# Altium project BCI_EEG.PrjPcb
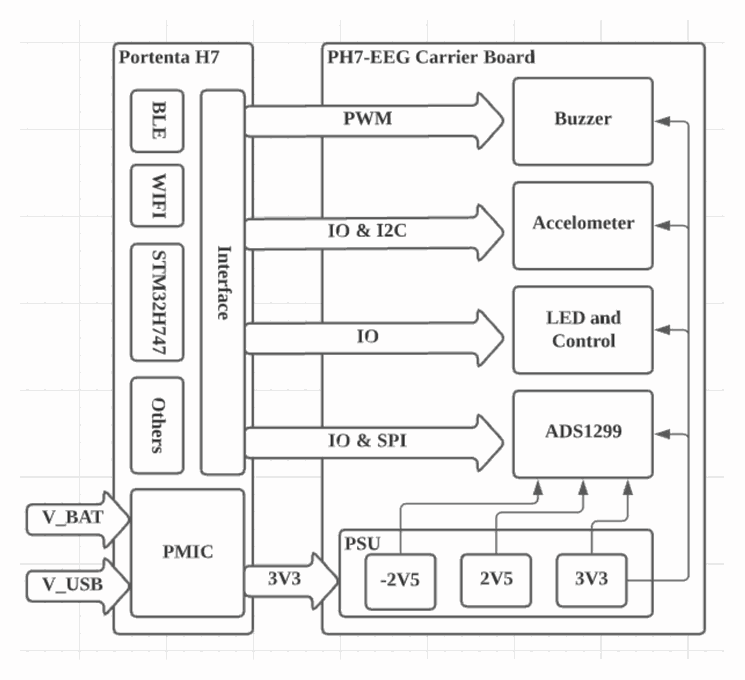
[diagram p0: Block Diagram.SchDoc]
4 sheets, 167 parts. Net scope: global (net labels, ports and power ports of the same name join across sheets).
Board file: BCI_EEG.pcbdoc
Sheets:
  Block Diagram.SchDoc
  EEG Front-End.SchDoc
  MainBoardNew.SchDoc
  PWR & Sensor Input.SchDoc

## Sheet Block Diagram.SchDoc
size A4

## Sheet EEG Front-End.SchDoc
size A4
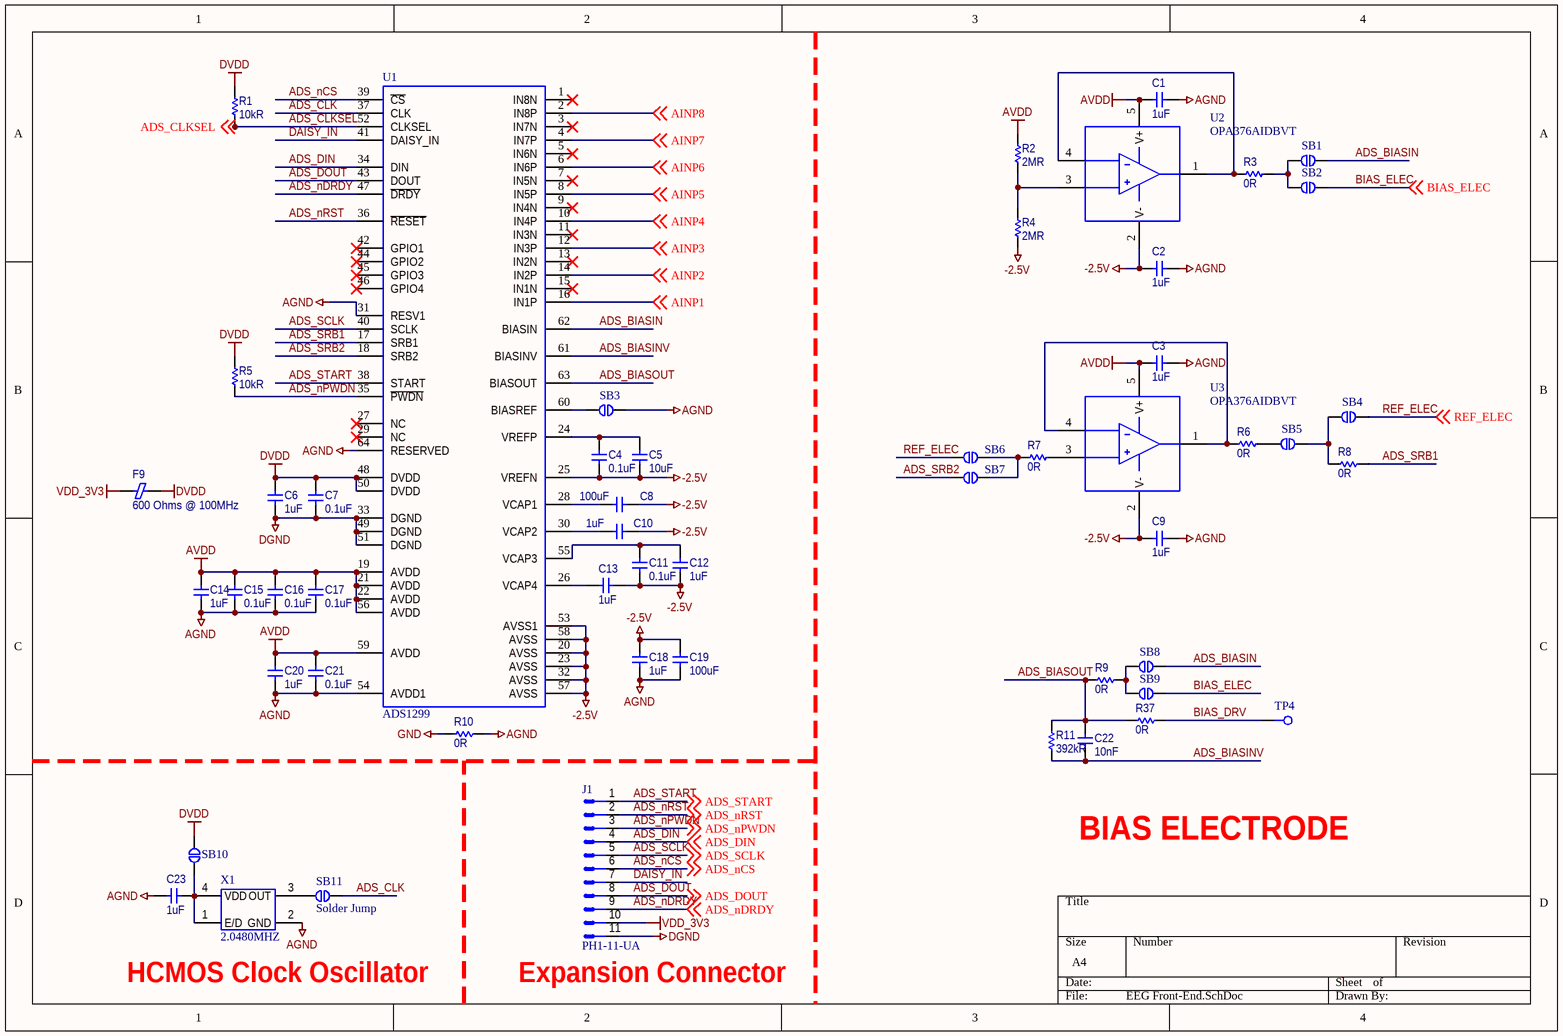
[diagram p1: EEG Front-End.SchDoc]

### Parts
C1  1uF  [C1005X04N]
C2  1uF  [C1005X04N]
C3  1uF  [C1005X04N]
C4  0.1uF  [C1005X04N]
C5  10uF  [C1608X06N]
C6  1uF  [C1005X04N]
C7  0.1uF  [C1005X04N]
C8  100uF  [C2012X06N]
C9  1uF  [C1005X04N]
C10  1uF  [C1005X04N]
C11  0.1uF  [C1005X04N]
C12  1uF  [C1005X04N]
C13  1uF  [C1005X04N]
C14  1uF  [C1005X04N]
C15  0.1uF  [C1005X04N]
C16  0.1uF  [C1005X04N]
C17  0.1uF  [C1005X04N]
C18  1uF  [C1005X04N]
C19  100uF  [C2012X06N]
C20  1uF  [C1005X04N]
C21  0.1uF  [C1005X04N]
C22  10nF  [C1005X04N]
C23  1uF  [C1005X04N]
F9  600 Ohms @ 100MHz  [F1005X04N]
J1  PH1-11-UA  [HDR1x11 - 2.54mm]
R1  10kR  [R1005X04N]
R2  2MR  [R1005X04N]
R3  0R  [R1005X04N]
R4  2MR  [R1005X04N]
R5  10kR  [R1005X04N]
R6  0R  [R1005X04N]
R7  0R  [R1005X04N]
R8  0R  [R1005X04N]
R9  0R  [R1005X04N]
R10  0R  [R1005X04N]
R11  392kR  [R1005X04N]
R37  0R  [R1005X04N]
SB1  Solder Jump  [SJB_0603]  (value not drawn)
SB2  Solder Jump  [SJB_0603]  (value not drawn)
SB3  Solder Jump  [SJB_0603]  (value not drawn)
SB4  Solder Jump  [SJB_0603]  (value not drawn)
SB5  Solder Jump  [SJB_0603]  (value not drawn)
SB6  Solder Jump  [SJB_0603]  (value not drawn)
SB7  Solder Jump  [SJB_0603]  (value not drawn)
SB8  Solder Jump  [SJB_0603]  (value not drawn)
SB9  Solder Jump  [SJB_0603]  (value not drawn)
SB10  Solder Jump  [SJB_0603]  (value not drawn)
SB11  Solder Jump  [SJB_0603]
TP4  TP_25MILC  [TESTPOINT_1MM]  (value not drawn)  (no BOM)
U1  ADS1299  [PQFN-64]
U2  OPA376AIDBVT  [SOT23-5]
U3  OPA376AIDBVT  [SOT23-5]
X1  2.0480MHZ  [CRYSTAL_3225]

### Nets
-2.5V: C2.2 C4.1 C5.1 C8.2 C9.2 C10.2 C11.1 C12.2 C13.1 C18.2 C19.2 R4.1 U1.20(AVSS) U1.23(AVSS) U1.25(VREFN) U1.32(AVSS) U1.53(AVSS1) U1.57(AVSS) U1.58(AVSS) U2.2(V-) U3.2(V-)
AGND: C1.1 C2.1 C3.1 C9.1 C14.2 C15.1 C16.1 C17.1 C18.1 C19.1 C20.2 C21.1 C23.1 R10.2 SB3.1 U1.31(RESV1) U1.54(AVDD1) U1.64(RESERVED) X1.2(GND)
AVDD: C1.2 C3.2 C14.1 C15.2 C16.2 C17.2 C20.1 C21.2 R2.2 U1.19(AVDD) U1.21(AVDD) U1.22(AVDD) U1.56(AVDD) U1.59(AVDD) U2.5(V+) U3.5(V+)
DGND: C6.2 C7.1 J1.11 U1.33(DGND) U1.49(DGND) U1.51(DGND)
DVDD: C6.1 C7.2 F9.2 R1.2 R5.2 SB10.1 U1.48(DVDD) U1.50(DVDD)
GND: R10.1
VDD_3V3: F9.1 J1.10
ADS_BIASIN: SB1.1 SB8.1 U1.62(BIASIN)
ADS_BIASINV: C22.1 R11.1 U1.61(BIASINV)
ADS_BIASOUT: C22.2 R9.1 R11.2 R37.1 U1.63(BIASOUT)
ADS_CLK: SB11.2 U1.37(CLK)
ADS_CLKSEL: R1.1 U1.52(CLKSEL) ; off-sheet ADS_CLKSEL
ADS_DIN: J1.4 U1.34(DIN) ; off-sheet ADS_DIN
ADS_DOUT: J1.8 U1.43(DOUT) ; off-sheet ADS_DOUT
ADS_nCS: J1.6 U1.39(~{CS}) ; off-sheet ADS_nCS
ADS_nDRDY: J1.9 U1.47(~{DRDY}) ; off-sheet ADS_nDRDY
ADS_nPWDN: J1.3 R5.1 U1.35(~{PWDN}) ; off-sheet ADS_nPWDN
ADS_nRST: J1.2 U1.36(~{RESET}) ; off-sheet ADS_nRST
ADS_SCLK: J1.5 U1.40(SCLK) ; off-sheet ADS_SCLK
ADS_SRB1: R8.2 U1.17(SRB1)
ADS_SRB2: SB7.2 U1.18(SRB2)
ADS_START: J1.1 U1.38(START) ; off-sheet ADS_START
AINP1: U1.16(IN1P) ; off-sheet AINP1
AINP2: U1.14(IN2P) ; off-sheet AINP2
AINP3: U1.12(IN3P) ; off-sheet AINP3
AINP4: U1.10(IN4P) ; off-sheet AINP4
AINP5: U1.8(IN5P) ; off-sheet AINP5
AINP6: U1.6(IN6P) ; off-sheet AINP6
AINP7: U1.4(IN7P) ; off-sheet AINP7
AINP8: U1.2(IN8P) ; off-sheet AINP8
BIAS_DRV: R37.2 TP4.1
BIAS_ELEC: SB2.1 SB9.1 ; off-sheet BIAS_ELEC
DAISY_IN: J1.7 U1.41(DAISY_IN)
REF_ELEC: SB4.2 SB6.2 ; off-sheet REF_ELEC
NetC4_2: C4.2 C5.2 U1.24(VREFP)
NetC8_1: C8.1 U1.28(VCAP1)
NetC10_1: C10.1 U1.30(VCAP2)
NetC11_2: C11.2 C12.1 U1.55(VCAP3)
NetC13_2: C13.2 U1.26(VCAP4)
NetC23_2: C23.2 SB10.2 X1.1(E/D) X1.4(VDD)
NetR2_1: R2.1 R4.2 U2.3(IN+)
NetR3_1: R3.1 U2.1(VO) U2.4(IN-)
NetR3_2: R3.2 SB1.2 SB2.2
NetR6_1: R6.1 U3.1(VO) U3.4(IN-)
NetR6_2: R6.2 SB5.2
NetR7_1: R7.1 SB6.1 SB7.1
NetR7_2: R7.2 U3.3(IN+)
NetR8_1: R8.1 SB4.1 SB5.1
NetR9_2: R9.2 SB8.2 SB9.2
NetSB3_2: SB3.2 U1.60(BIASREF)
NetSB11_1: SB11.1 X1.3(OUT)

Not connected (* = marked no-connect by the designer): U1 1(IN8N)* 3(IN7N)* 5(IN6N)* 7(IN5N)* 9(IN4N)* 11(IN3N)* 13(IN2N)* 15(IN1N)* 27(NC)* 29(NC)* 42(GPIO1)* 44(GPIO2)* 45(GPIO3)* 46(GPIO4)*

### Notes on the sheet
- BIAS ELECTRODE
- (near X1) HCMOS Clock Oscillator
- (near J1) Expansion Connector

### Library data of the parts
C1-C3 C6 C9 C10 C12-C14 C18 C20 C23 = EMK105BJ105KV-F: CAP CER,1UF,10%,16V,X5R,0402,SMD; Manufacturer: Taiyo Yuden; No: 96; Capacitor Type: Ceramic Capacitor; Manufacturer Part Number: EMK105BJ105KV-F; VNPT Part Number: EMK105BJ105KV-F; Capacitance: 1uF; Voltage - Rated: 16V; Tolerance: 10%; Mounting Type: Surface Mount (SMD); Package: 0402; Temperature Coefficient: X5R
C4 C7 C11 C15-C17 C21 = TMK105BJ104MV-F: CAP CER,0.1UF,20%,25V,X5R,0402,SMD; Manufacturer: Taiyo Yuden; No: 79; Capacitor Type: Ceramic Capacitor; Manufacturer Part Number: TMK105BJ104MV-F; VNPT Part Number: TMK105BJ104MV-F; Capacitance: 0.1uF; Voltage - Rated: 25V; Tolerance: 20%; Mounting Type: Surface Mount (SMD); Package: 0402; Temperature Coefficient: X5R
C5 = LMK107BBJ106MAHT: CAP CER,10UF,20%,10V,X5R,0603,SMD; Manufacturer: Taiyo Yuden; No: 31; Capacitor Type: Ceramic Capacitor; Manufacturer Part Number: LMK107BBJ106MAHT; VNPT Part Number: LMK107BBJ106MAHT; Capacitance: 10uF; Voltage - Rated: 10V; Tolerance: 20%; Mounting Type: Surface Mount (SMD); Package: 0603; Temperature Coefficient: X5R
C8 C19 = GRM21BR60J107ME15L: CAP CER,100UF,20%,6.3V,X5R,0805,SMD; Manufacturer: Murata Electronics; No: 71; Capacitor Type: Ceramic Capacitor; Manufacturer Part Number: GRM21BR60J107ME15L; VNPT Part Number: GRM21BR60J107ME15L; Capacitance: 100uF; Voltage - Rated: 6.3V; Tolerance: 20%; Mounting Type: Surface Mount (SMD); Package: 0805; Temperature Coefficient: X5R
C22 = UMK105B7103KV-F: CAP CER,10NF,10%,50V,X7R,0402,SMD; Manufacturer: Taiyo Yuden; No: 33; Capacitor Type: Ceramic Capacitor; Manufacturer Part Number: UMK105B7103KV-F; VNPT Part Number: UMK105B7103KV-F; Capacitance: 10nF; Voltage - Rated: 50V; Tolerance: 10%; Mounting Type: Surface Mount (SMD); Package: 0402; Temperature Coefficient: X7R
F9 = BK1005HS601-T: FERRITE BEAD,600 OHMS @ 100MHZ,0.55R,300MA,0402,SMD; Manufacturer: Taiyo Yuden; No: 3; Manufacturer Part Number: BK1005HS601-T; VNPT Part Number: BK1005HS601-T; Impedance: 600 Ohms @ 100MHz; DC Resistance (DCR): 0.55R; Current Rating: 300mA; Mounting Type: Surface Mount (SMD); Package: 0402
J1 = PH1-11-UA: CONN HEADER VERT 11POS 2.54MM
R1 R5 = RC0402FR-0710KL: RES,10KR,1%,62.5MW,0402,SMD; Manufacturer: Yageo; No: 35; Manufacturer Part Number: RC0402FR-0710KL; VNPT Part Number: RC0402FR-0710KL; Resistance: 10kR; Tolerance: 1%; Power: 62.5mW; Resistor Type: Genneral Purpose Resistor; Mounting Type: Surface Mount (SMD); Package: 0402
R2 R4 = CRCW04022M00FKEDC: RES,2MR,1%,62.5MW,0402,SMD; Manufacturer: Vishay / Dale; No: 135; Manufacturer Part Number: CRCW04022M00FKEDC; VNPT Part Number: CRCW04022M00FKEDC; Resistance: 2MR; Tolerance: 1%; Power: 62.5mW; Resistor Type: Genneral Purpose Resistor; Mounting Type: Surface Mount (SMD); Package: 0402
R3 R6-R10 R37 = RC0402FR-070RL: RES,0R,JUMPER,62.5MW,0402,SMD; Manufacturer: Yageo; No: 7; Manufacturer Part Number: RC0402FR-070RL; VNPT Part Number: RC0402FR-070RL; Resistance: 0R; Tolerance: JUMPER; Power: 62.5mW; Resistor Type: Genneral Purpose Resistor; Mounting Type: Surface Mount (SMD); Package: 0402
R11 = CRCW0402392KFKED: RES,392KR,1%,62.5MW,0402,SMD; Manufacturer: Vishay / Dale; No: 136; Manufacturer Part Number: CRCW0402392KFKED; VNPT Part Number: CRCW0402392KFKED; Resistance: 392kR; Tolerance: 1%; Power: 62.5mW; Resistor Type: Genneral Purpose Resistor; Mounting Type: Surface Mount (SMD); Package: 0402
SB1-SB11 = Solder Jump: Solder Bridge Jumper 0603
TP4 = TP_25MILC: Test Point 25mil
U1 = ADS1299IPAGR: IC AFE 8 CHAN 24BIT 64TQFP; Manufacturer: Texas Instruments; Manufacturer Part Number: ADS1299IPAGR
U2 U3 = OPA376AIDBVT: IC OPAMP GP 1 CIRCUIT SOT23-5; Manufacturer: Texas Instruments; Manufacturer Part Number: OPA376AIDBVT
X1 = 632L3I002M04800: XTAL OSC XO 2.0480MHZ HCMOS SMD; Manufacturer: CTS-Frequency Controls; Parameter 1: *

## Sheet MainBoardNew.SchDoc
size A4
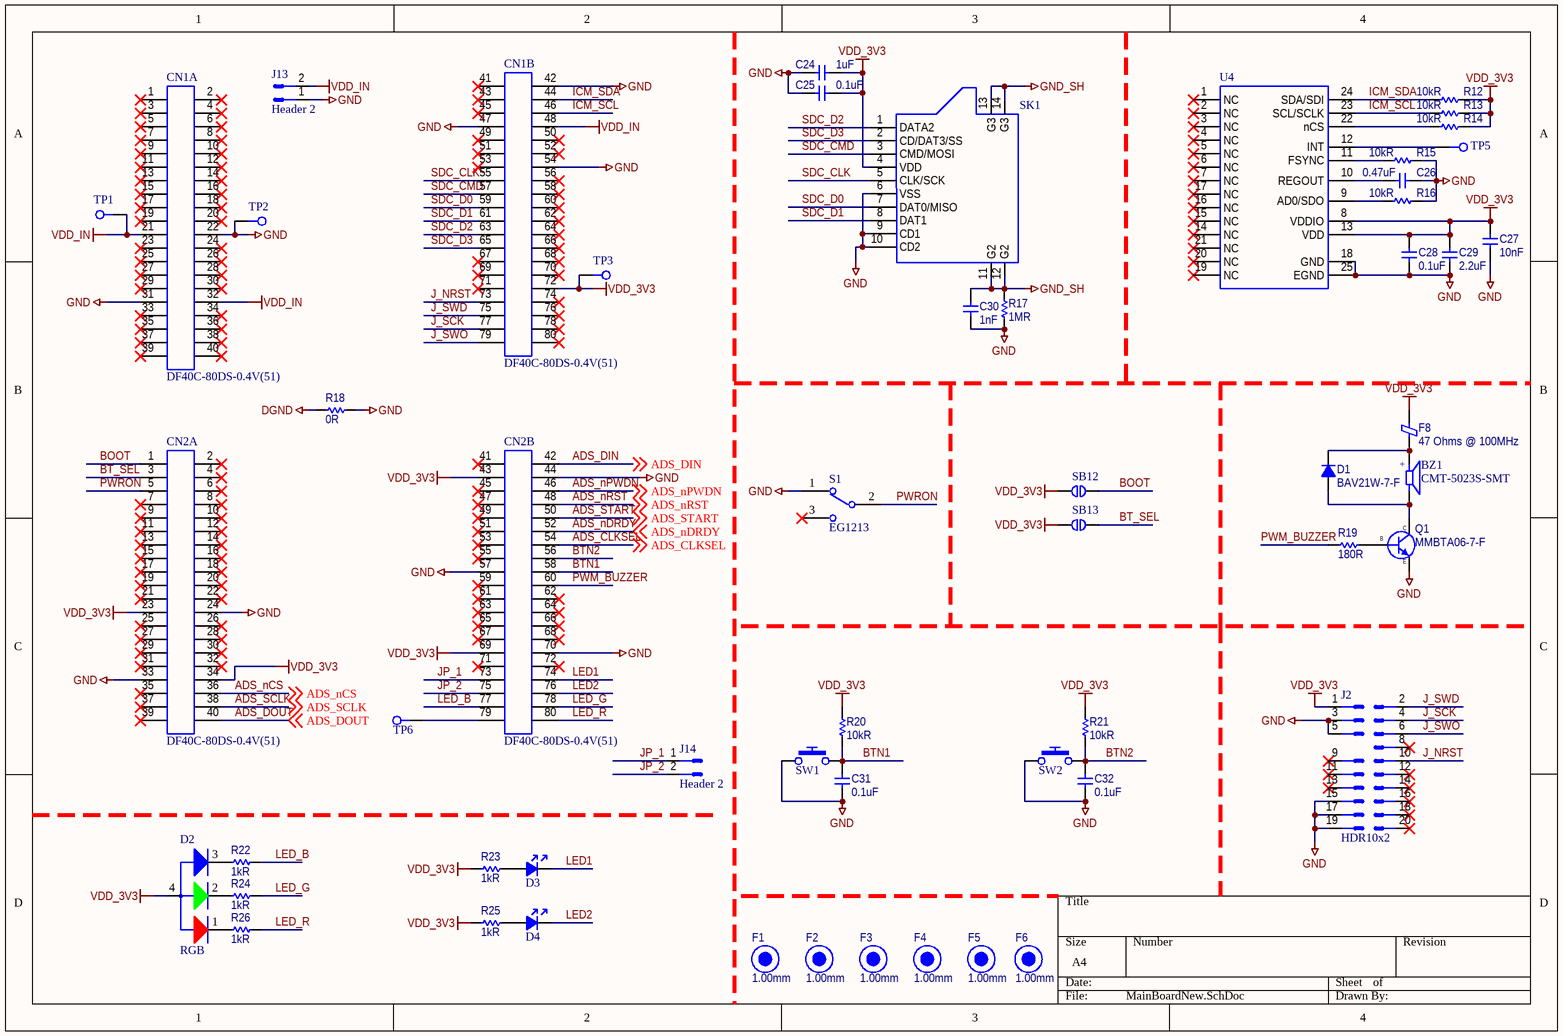
[diagram p2: MainBoardNew.SchDoc]

### Parts
BZ1  CMT-5023S-SMT  [CUI_CMT-5023S-SMT]
C24  1uF  [C1005X04N]
C25  0.1uF  [C1005X04N]
C26  0.47uF  [C1005X04N]
C27  10nF  [C1005X04N]
C28  0.1uF  [C1005X04N]
C29  2.2uF  [C1005X04N]
C30  1nF  [C1005X04N]
C31  0.1uF  [C1005X04N]
C32  0.1uF  [C1005X04N]
CN1  DF40C-80DS-0.4V(51)  [DF40C-80DS-0.4V(51)]  (parts A,B of 2)
CN2  DF40C-80DS-0.4V(51)  [DF40C-80DS-0.4V(51)]  (parts A,B of 2)
D1  BAV21W-7-F  [SOD123]
D2  RGB  [LED 3528 PLCC4 RGB]
D3  LED BLUE  [LED0603]  (value not drawn)
D4  LED BLUE  [LED0603]  (value not drawn)
F1  1.00mm  [FIDUCIAL10-30]
F2  1.00mm  [FIDUCIAL10-30]
F3  1.00mm  [FIDUCIAL10-30]
F4  1.00mm  [FIDUCIAL10-30]
F5  1.00mm  [FIDUCIAL10-30]
F6  1.00mm  [FIDUCIAL10-30]
F8  47 Ohms @ 100MHz  [F2012X06N]
J2  HDR10x2  [FTSH-110-01-L-DV-007-P-TR]
J13  Header 2  [HDR1x2]
J14  Header 2  [HDR1x2]
Q1  MMBTA06-7-F  [SOT95P245X110-3N]
R12  10kR  [R1005X04N]
R13  10kR  [R1005X04N]
R14  10kR  [R1005X04N]
R15  10kR  [R1005X04N]
R16  10kR  [R1005X04N]
R17  1MR  [R1005X04N]
R18  0R  [R1005X04N]
R19  180R  [R1005X04N]
R20  10kR  [R1005X04N]
R21  10kR  [R1005X04N]
R22  1kR  [R1005X04N]
R23  1kR  [R1005X04N]
R24  1kR  [R1005X04N]
R25  1kR  [R1005X04N]
R26  1kR  [R1005X04N]
S1  EG1213  [SW_EG1213]
SB12  Solder Jump  [SJB_0603]  (value not drawn)
SB13  Solder Jump  [SJB_0603]  (value not drawn)
SK1  MICRO SD CARD  [114-00841-68]  (value not drawn)
SW1  FSMRA4JH04  [1-1825027-1]  (value not drawn)
SW2  FSMRA4JH04  [1-1825027-1]  (value not drawn)
TP1  TP_25MILC  [TESTPOINT_1MM]  (value not drawn)  (no BOM)
TP2  TP_25MILC  [TESTPOINT_1MM]  (value not drawn)  (no BOM)
TP3  TP_25MILC  [TESTPOINT_1MM]  (value not drawn)  (no BOM)
TP5  TP_25MILC  [TESTPOINT_1MM]  (value not drawn)  (no BOM)
TP6  TP_25MILC  [TESTPOINT_1MM]  (value not drawn)  (no BOM)
U4  ICM-20689  [QFN50P400X400X100_HS-25N-NP]  (value not drawn)

### Nets
DGND: R18.1
GND: C24.1 C25.2 C26.2 C27.1 C28.2 C29.1 C30.1 C31.1 C32.1 CN1.22 CN1.31 CN1.42 CN1.47 CN1.54 CN2.24 CN2.33 CN2.44 CN2.57 CN2.70 J2.3 J2.5 J2.15 J2.17 J2.19 J13.1 Q1.2(E) R15.1 R16.1 R17.1 R18.2 S1.1 SK1.6(VSS) SK1.9(CD1) SK1.10(CD2) SW1.1 SW2.1 TP2.1 U4.18(GND) U4.25(EGND)
GND_SH: C30.2 R17.2 SK1.11(G2) SK1.12(G2) SK1.13(G3) SK1.14(G3)
VDD_3V3: C24.2 C25.1 C27.2 C28.1 C29.2 CN1.72 CN2.23 CN2.34 CN2.43 CN2.69 D2.4(COMM_ANODE) F8.2 J2.1 R12.1 R13.1 R14.1 R20.2 R21.2 R23.1 R25.1 SB12.2 SB13.2 SK1.4(VDD) TP3.1 U4.8(VDDIO) U4.13(VDD)
VDD_IN: CN1.21 CN1.32 CN1.48 J13.2 TP1.1
ADS_CLKSEL: CN2.54 ; off-sheet ADS_CLKSEL
ADS_DIN: CN2.42 ; off-sheet ADS_DIN
ADS_DOUT: CN2.40 ; off-sheet ADS_DOUT
ADS_nCS: CN2.36 ; off-sheet ADS_nCS
ADS_nDRDY: CN2.52 ; off-sheet ADS_nDRDY
ADS_nPWDN: CN2.46 ; off-sheet ADS_nPWDN
ADS_nRST: CN2.48 ; off-sheet ADS_nRST
ADS_SCLK: CN2.38 ; off-sheet ADS_SCLK
ADS_START: CN2.50 ; off-sheet ADS_START
BOOT: CN2.1 SB12.1
BT_SEL: CN2.3 SB13.1
BTN1: C31.2 CN2.58 R20.1 SW1.2
BTN2: C32.2 CN2.56 R21.1 SW2.2
ICM_SCL: CN1.46 R13.2 U4.23(SCL/SCLK)
ICM_SDA: CN1.44 R12.2 U4.24(SDA/SDI)
J_NRST: CN1.73 J2.10
J_SCK: CN1.77 J2.4
J_SWD: CN1.75 J2.2
J_SWO: CN1.79 J2.6
JP_1: CN2.73 J14.1
JP_2: CN2.75 J14.2
LED1: CN2.74 D3.2(K)
LED2: CN2.76 D4.2(K)
LED_B: CN2.77 R22.2
LED_G: CN2.78 R24.2
LED_R: CN2.80 R26.2
PWM_BUZZER: CN2.60 R19.1
PWRON: CN2.5 S1.2
SDC_CLK: CN1.55 SK1.5(CLK/SCK)
SDC_CMD: CN1.57 SK1.3(CMD/MOSI)
SDC_D0: CN1.59 SK1.7(DAT0/MISO)
SDC_D1: CN1.61 SK1.8(DAT1)
SDC_D2: CN1.63 SK1.1(DATA2)
SDC_D3: CN1.65 SK1.2(CD/DAT3/SS)
NetBZ1_N: BZ1.N D1.2(A) Q1.3(C)
NetBZ1_P: BZ1.P D1.1(C) F8.1
NetC26_1: C26.1 U4.10(REGOUT)
NetCN2_79: CN2.79 TP6.1
NetD2_1: D2.1(CATHODE_RED) R26.1
NetD2_2: D2.2(CATHODE_GREEN) R24.1
NetD2_3: D2.3(CATHODE_BLUE) R22.1
NetD3_1: D3.1(A) R23.2
NetD4_1: D4.1(A) R25.2
NetQ1_1: Q1.1(B) R19.2
NetR14_2: R14.2 U4.22(nCS)
NetR15_2: R15.2 U4.11(FSYNC)
NetR16_2: R16.2 U4.9(AD0/SDO)
NetTP5_1: TP5.1 U4.12(INT)

Not connected (* = marked no-connect by the designer): CN1 1* 2* 3* 4* 5* 6* 7* 8* 9* 10* 11* 12* 13* 14* 15* 16* 17* 18* 19* 20* 23* 24* 25* 26* 27* 28* 29* 30* 33* 34* 35* 36* 37* 38* 39* 40* 41* 43* 45* 49* 50* 51* 52* 53* 56* 58* 60* 62* 64* 66* 67* 68* 69* 70* 71* 74* 76* 78* 80*; CN2 2* 4* 6* 7* 8* 9* 10* 11* 12* 13* 14* 15* 16* 17* 18* 19* 20* 21* 22* 25* 26* 27* 28* 29* 30* 31* 32* 35* 37* 39* 41* 45* 47* 49* 51* 53* 55* 59* 61* 62* 63* 64* 65* 66* 67* 68* 71* 72*; J2 8* 9* 11* 12* 13* 14* 16* 18* 20*; S1 3*; U4 1(NC)* 2(NC)* 3(NC)* 4(NC)* 5(NC)* 6(NC)* 7(NC)* 14(NC)* 15(NC)* 16(NC)* 17(NC)* 19(NC)* 20(NC)* 21(NC)*

### Notes on the sheet
- (in symbol CMT-5023S-SMT) +

### Library data of the parts
BZ1 = CMT-5023S-SMT: AUDIO MAGNETIC XDCR 2-4V SMD; Manufacturer: CUI Devices; Manufacturer Part Number: CMT-5023S-SMT-TR
C24 = EMK105BJ105KV-F: as C1 on sheet EEG Front-End; Manufacturer Part Number: EMK105BJ105KV-F; VNPT Part Number: EMK105BJ105KV-F; Capacitance: 1uF; Voltage - Rated: 16V; Tolerance: 10%; Mounting Type: Surface Mount (SMD); Package: 0402; Temperature Coefficient: X5R
C25 C28 C31 C32 = TMK105BJ104MV-F: as C4 on sheet EEG Front-End; Manufacturer Part Number: TMK105BJ104MV-F; VNPT Part Number: TMK105BJ104MV-F; Capacitance: 0.1uF; Voltage - Rated: 25V; Tolerance: 20%; Mounting Type: Surface Mount (SMD); Package: 0402; Temperature Coefficient: X5R
C26 = TMK105ABJ474KVHF: CAP CER,0.47UF,10%,25V,X5R,0402,SMD; Manufacturer: Taiyo Yuden; No: 122; Capacitor Type: Ceramic Capacitor; Manufacturer Part Number: TMK105ABJ474KVHF; VNPT Part Number: TMK105ABJ474KVHF; Capacitance: 0.47uF; Voltage - Rated: 25V; Tolerance: 10%; Mounting Type: Surface Mount (SMD); Package: 0402; Temperature Coefficient: X5R
C27 = UMK105B7103KV-F: as C22 on sheet EEG Front-End; Manufacturer Part Number: UMK105B7103KV-F; VNPT Part Number: UMK105B7103KV-F; Capacitance: 10nF; Voltage - Rated: 50V; Tolerance: 10%; Mounting Type: Surface Mount (SMD); Package: 0402; Temperature Coefficient: X7R
C29 = TMK105CBJ225MV-F: CAP CER,2.2UF,20%,25V,X5R,0402,SMD; Manufacturer: Taiyo Yuden; No: 140; Capacitor Type: Ceramic Capacitor; Manufacturer Part Number: TMK105CBJ225MV-F; VNPT Part Number: TMK105CBJ225MV-F; Capacitance: 2.2uF; Voltage - Rated: 25V; Tolerance: 20%; Mounting Type: Surface Mount (SMD); Package: 0402; Temperature Coefficient: X5R
C30 = UMK105B7102KV-F: CAP CER,1NF,10%,50V,X7R,0402,SMD; Manufacturer: Taiyo Yuden; No: 120; Capacitor Type: Ceramic Capacitor; Manufacturer Part Number: UMK105B7102KV-F; VNPT Part Number: UMK105B7102KV-F; Capacitance: 1nF; Voltage - Rated: 50V; Tolerance: 10%; Mounting Type: Surface Mount (SMD); Package: 0402; Temperature Coefficient: X7R
CN1 CN2 = DF40C-80DS-0.4V(51): CONN RCPT 80POS SMD GOLD; Manufacturer: Hirose Electric Co Ltd; Manufacturer Part Number: DF40C-80DS-0.4V(51)
D1 = BAV21W-7-F: DIODE,200V,200MA,1-CH,ID,SOD-123,SMD; Manufacturer: Diodes Incorporated; No: 22; Diode Type: Standard Diode; Number of Channel: 1; Manufacturer Part Number: BAV21W-7-F; VNPT Part Number: BAV21W-7-F; Voltage - DC Reverse (Vr): 200V; Current - Average Rectified (If): 200mA; Mounting Type: Surface Mount (SMD); Package: SOD-123
D2 = BL-HJXGXBX32M-A: 3528 PLCC4 RGB; Manufacturer: American Bright Optoelectronics Corporation; Manufacturer Part Number: BL-HJXGXBX32M-A
D3 D4 = LTST-C191TBKT: LED BLUE CLEAR CHIP SMD
F1-F6 = FIDUCIAL10-30: FIDUCIAL,1.00mm,3.00mm; Manufacturer: VNPT-Technology; No: 5; Manufacturer Part Number: FIDUCIAL10-30; VNPT Part Number: FIDUCIAL10-30; Mounted Pad: 1.00mm; Solder Mask: 3.00mm; Keepout Diameter: 3.00mm; Assembly Top: 1.00mm
F8 = BK2125HS470-T: FERRITE BEAD,47 OHMS @ 100MHZ,0.05R,1A,0805,SMD; Manufacturer: Taiyo Yuden; No: 4; Manufacturer Part Number: BK2125HS470-T; VNPT Part Number: BK2125HS470-T; Impedance: 47 Ohms @ 100MHz; DC Resistance (DCR): 0.05R; Current Rating: 1A; Mounting Type: Surface Mount (SMD); Package: 0805
J2 = FTSH-110-01-L-DV-007-P-TR: CONN HEADER SMD 20POS 1.27MM; Parameter 1: *; Parameter 2: *; Parameter 3: *
Q1 = MMBTA06-7-F: BJT NPN,80V,500MA,SOT23-3,SMD; Manufacturer: Diodes Incorporated; No: 9; Manufacturer Part Number: MMBTA06-7-F; VNPT Part Number: MMBTA06-7-F; BJT Type: NPN; Vce (Max): 80V; Ic (Max): 500mA; Mounting Type: Surface Mount (SMD); Package: SOT23-3 (SOT23, TO236AB, SOT346, SC59A, TO236AA, SMT3)
R12-R16 R20 R21 = RC0402FR-0710KL: as R1 on sheet EEG Front-End; Manufacturer Part Number: RC0402FR-0710KL; VNPT Part Number: RC0402FR-0710KL; Resistance: 10kR; Tolerance: 1%; Power: 62.5mW; Resistor Type: Genneral Purpose Resistor; Mounting Type: Surface Mount (SMD); Package: 0402
R17 = RC0402FR-071ML: RES,1MR,1%,62.5MW,0402,SMD; Manufacturer: Yageo; No: 52; Manufacturer Part Number: RC0402FR-071ML; VNPT Part Number: RC0402FR-071ML; Resistance: 1MR; Tolerance: 1%; Power: 62.5mW; Resistor Type: Genneral Purpose Resistor; Mounting Type: Surface Mount (SMD); Package: 0402
R18 = RC0402FR-070RL: as R3 on sheet EEG Front-End; Manufacturer Part Number: RC0402FR-070RL; VNPT Part Number: RC0402FR-070RL; Resistance: 0R; Tolerance: JUMPER; Power: 62.5mW; Resistor Type: Genneral Purpose Resistor; Mounting Type: Surface Mount (SMD); Package: 0402
R19 = CRCW0402180RFKEDHP: RES,180R,1%,200MW,0402,SMD; Manufacturer: Vishay / Dale; No: 137; Manufacturer Part Number: CRCW0402180RFKEDHP; VNPT Part Number: CRCW0402180RFKEDHP; Resistance: 180R; Tolerance: 1%; Power: 200mW; Resistor Type: Genneral Purpose Resistor; Mounting Type: Surface Mount (SMD); Package: 0402
R22-R26 = RC0402JR-071KL: RES,1KR,5%,62.5MW,0402,SMD; Manufacturer: Yageo; No: 63; Manufacturer Part Number: RC0402JR-071KL; VNPT Part Number: RC0402JR-071KL; Resistance: 1kR; Tolerance: 5%; Power: 62.5mW; Resistor Type: Genneral Purpose Resistor; Mounting Type: Surface Mount (SMD); Package: 0402
S1 = EG1213: SWITCH SLIDE SPDT 200MA 30V; Manufacturer: E-Switch; Manufacturer Part Number: EG1213
SB12 SB13 = Solder Jump: Solder Bridge Jumper 0603
SK1 = 114-00841-68: CONN MICRO SD CARD PUSH-PULL R/A; Manufacturer: Amphenol ICC (Commercial Products); Manufacturer Part Number: 114-00841-68
SW1 SW2 = FSMRA4JH04: SWITCH TACTILE SPST-NO 0.05A 24V; Manufacturer: TE Connectivity; Manufacturer Part Number: FSMRA4JH04
TP1-TP3 TP5 TP6 = TP_25MILC: Test Point 25mil
U4 = ICM-20689: IMU ACCEL/GYRO/MAG I2C/SPI 24QFN; Manufacturer: TDK InvenSense; Manufacturer Part Number: ICM-20689

## Sheet PWR & Sensor Input.SchDoc
size A4
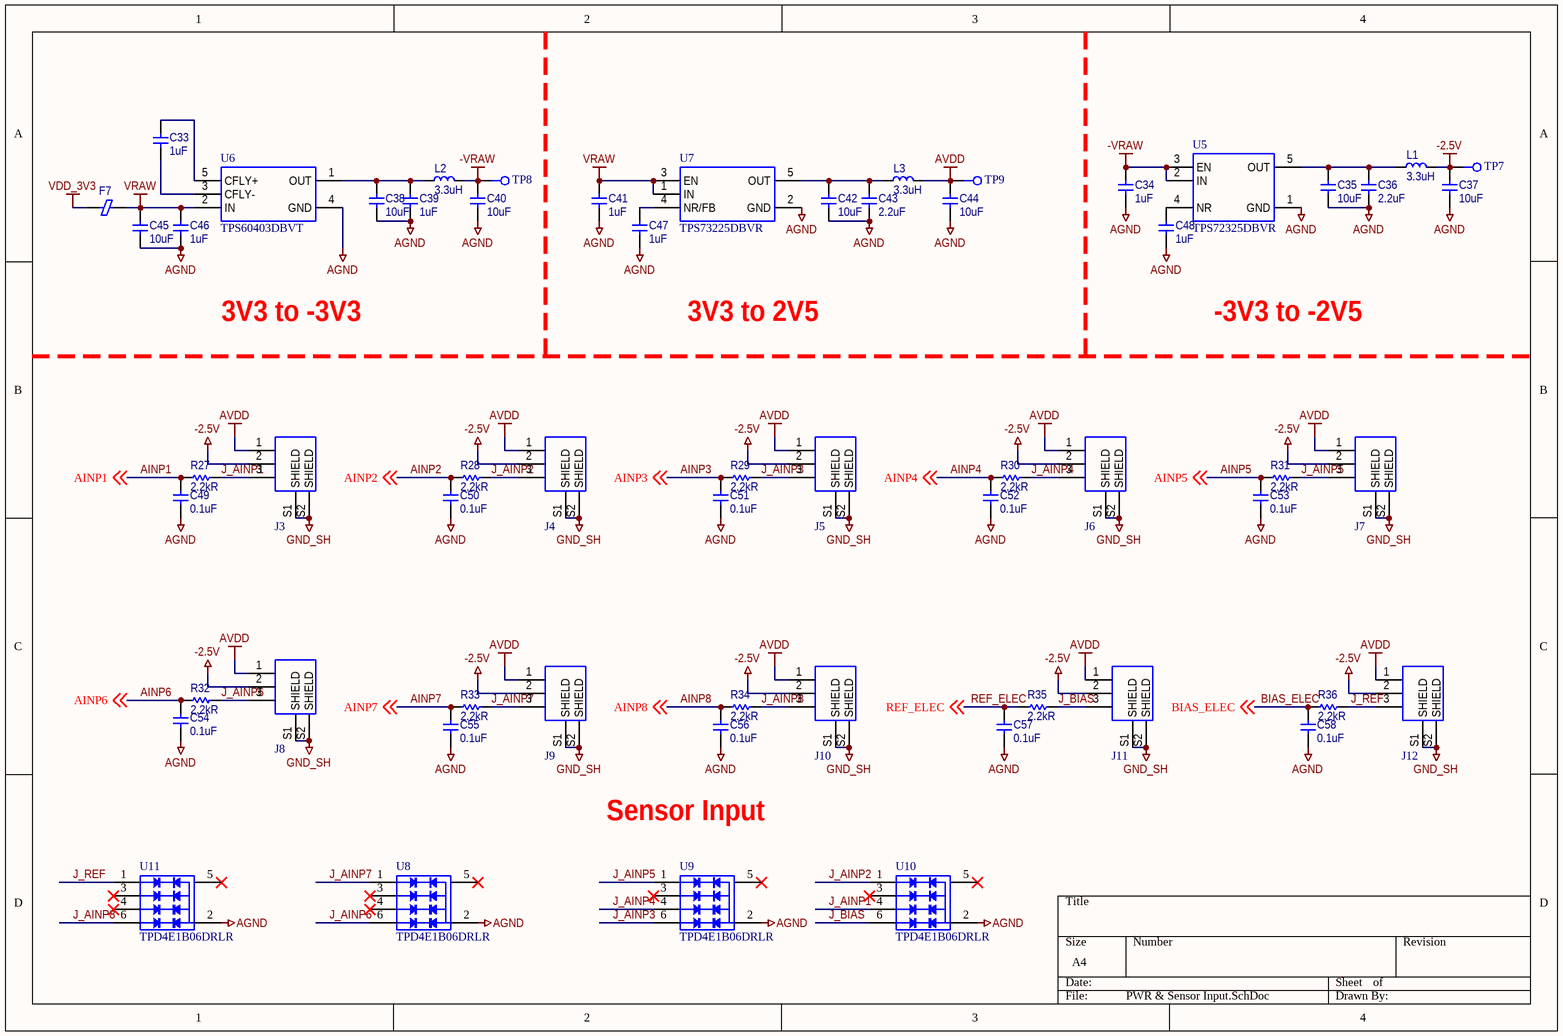
[diagram p3: PWR & Sensor Input.SchDoc]

### Parts
C33  1uF  [C1005X04N]
C34  1uF  [C1005X04N]
C35  10uF  [C1608X06N]
C36  2.2uF  [C1005X04N]
C37  10uF  [C1608X06N]
C38  10uF  [C1608X06N]
C39  1uF  [C1005X04N]
C40  10uF  [C1608X06N]
C41  1uF  [C1005X04N]
C42  10uF  [C1608X06N]
C43  2.2uF  [C1005X04N]
C44  10uF  [C1608X06N]
C45  10uF  [C1608X06N]
C46  1uF  [C1005X04N]
C47  1uF  [C1005X04N]
C48  1uF  [C1005X04N]
C49  0.1uF  [C1005X04N]
C50  0.1uF  [C1005X04N]
C51  0.1uF  [C1005X04N]
C52  0.1uF  [C1005X04N]
C53  0.1uF  [C1005X04N]
C54  0.1uF  [C1005X04N]
C55  0.1uF  [C1005X04N]
C56  0.1uF  [C1005X04N]
C57  0.1uF  [C1005X04N]
C58  0.1uF  [C1005X04N]
F7  120 Ohms @ 100MHz  [F3216X07N]  (value not drawn)
J3  SM03B-SRSS-TB(LF)(SN)  [JST_SM03B-SRSS-TB(LF)(SN)]  (value not drawn)
J4  SM03B-SRSS-TB(LF)(SN)  [JST_SM03B-SRSS-TB(LF)(SN)]  (value not drawn)
J5  SM03B-SRSS-TB(LF)(SN)  [JST_SM03B-SRSS-TB(LF)(SN)]  (value not drawn)
J6  SM03B-SRSS-TB(LF)(SN)  [JST_SM03B-SRSS-TB(LF)(SN)]  (value not drawn)
J7  SM03B-SRSS-TB(LF)(SN)  [JST_SM03B-SRSS-TB(LF)(SN)]  (value not drawn)
J8  SM03B-SRSS-TB(LF)(SN)  [JST_SM03B-SRSS-TB(LF)(SN)]  (value not drawn)
J9  SM03B-SRSS-TB(LF)(SN)  [JST_SM03B-SRSS-TB(LF)(SN)]  (value not drawn)
J10  SM03B-SRSS-TB(LF)(SN)  [JST_SM03B-SRSS-TB(LF)(SN)]  (value not drawn)
J11  SM03B-SRSS-TB(LF)(SN)  [JST_SM03B-SRSS-TB(LF)(SN)]  (value not drawn)
J12  SM03B-SRSS-TB(LF)(SN)  [JST_SM03B-SRSS-TB(LF)(SN)]  (value not drawn)
L1  3.3uH  [L1608X06N]
L2  3.3uH  [L1608X06N]
L3  3.3uH  [L1608X06N]
R27  2.2kR  [R1005X04N]
R28  2.2kR  [R1005X04N]
R29  2.2kR  [R1005X04N]
R30  2.2kR  [R1005X04N]
R31  2.2kR  [R1005X04N]
R32  2.2kR  [R1005X04N]
R33  2.2kR  [R1005X04N]
R34  2.2kR  [R1005X04N]
R35  2.2kR  [R1005X04N]
R36  2.2kR  [R1005X04N]
TP7  TP_25MILC  [TESTPOINT_1MM]  (value not drawn)  (no BOM)
TP8  TP_25MILC  [TESTPOINT_1MM]  (value not drawn)  (no BOM)
TP9  TP_25MILC  [TESTPOINT_1MM]  (value not drawn)  (no BOM)
U5  TPS72325DBVR  [SOT23-5]
U6  TPS60403DBVT  [SOT23-5]
U7  TPS73225DBVR  [SOT23-5]
U8  TPD4E1B06DRLR  [SOT-563]
U9  TPD4E1B06DRLR  [SOT-563]
U10  TPD4E1B06DRLR  [SOT-563]
U11  TPD4E1B06DRLR  [SOT-563]

### Nets
-2.5V: C37.2 J3.2 J4.2 J5.2 J6.2 J7.2 J8.2 J9.2 J10.2 J11.2 J12.2 L1.2 TP7.1
-VRAW: C34.1 C40.2 L2.2 TP8.1 U5.2(IN) U5.3(EN)
AGND: C34.2 C35.1 C36.1 C37.1 C38.1 C39.2 C40.1 C41.2 C42.1 C43.1 C44.1 C45.1 C46.2 C47.2 C48.2 C49.1 C50.1 C51.1 C52.1 C53.1 C54.1 C55.1 C56.1 C57.1 C58.1 U5.1(GND) U6.4(GND) U7.2(GND) U8.2(GND) U9.2(GND) U10.2(GND) U11.2(GND)
AVDD: C44.2 J3.1 J4.1 J5.1 J6.1 J7.1 J8.1 J9.1 J10.1 J11.1 J12.1 L3.2 TP9.1
GND_SH: J3.S1(SHIELD) J3.S2(SHIELD) J4.S1(SHIELD) J4.S2(SHIELD) J5.S1(SHIELD) J5.S2(SHIELD) J6.S1(SHIELD) J6.S2(SHIELD) J7.S1(SHIELD) J7.S2(SHIELD) J8.S1(SHIELD) J8.S2(SHIELD) J9.S1(SHIELD) J9.S2(SHIELD) J10.S1(SHIELD) J10.S2(SHIELD) J11.S1(SHIELD) J11.S2(SHIELD) J12.S1(SHIELD) J12.S2(SHIELD)
VDD_3V3: F7.1
VRAW: C41.1 C45.2 C46.1 F7.2 U6.2(IN) U7.1(IN) U7.3(EN)
AINP1: C49.2 R27.1 ; off-sheet AINP1
AINP2: C50.2 R28.1 ; off-sheet AINP2
AINP3: C51.2 R29.1 ; off-sheet AINP3
AINP4: C52.2 R30.1 ; off-sheet AINP4
AINP5: C53.2 R31.1 ; off-sheet AINP5
AINP6: C54.2 R32.1 ; off-sheet AINP6
AINP7: C55.2 R33.1 ; off-sheet AINP7
AINP8: C56.2 R34.1 ; off-sheet AINP8
BIAS_ELEC: C58.2 R36.1 ; off-sheet BIAS_ELEC
J_AINP1: J3.3 R27.2 U10.4(IO3)
J_AINP2: J4.3 R28.2 U10.1(IO1)
J_AINP3: J5.3 R29.2 U9.6(IO4)
J_AINP4: J6.3 R30.2 U9.4(IO3)
J_AINP5: J7.3 R31.2 U9.1(IO1)
J_AINP6: J8.3 R32.2 U8.6(IO4)
J_AINP7: J9.3 R33.2 U8.1(IO1)
J_AINP8: J10.3 R34.2 U11.6(IO4)
J_BIAS: J11.3 R35.2 U10.6(IO4)
J_REF: J12.3 R36.2 U11.1(IO1)
REF_ELEC: C57.2 R35.1 ; off-sheet REF_ELEC
NetC33_1: C33.1 U6.5(CFLY+)
NetC33_2: C33.2 U6.3(CFLY-)
NetC35_2: C35.2 C36.2 L1.1 U5.5(OUT)
NetC38_2: C38.2 C39.1 L2.1 U6.1(OUT)
NetC42_2: C42.2 C43.2 L3.1 U7.5(OUT)
NetC47_1: C47.1 U7.4(NR/FB)
NetC48_1: C48.1 U5.4(NR)

Not connected (* = marked no-connect by the designer): U8 3(IO2)* 4(IO3)* 5(NC)*; U9 3(IO2)* 5(NC)*; U10 3(IO2)* 5(NC)*; U11 3(IO2)* 4(IO3)* 5(NC)*

### Notes on the sheet
- 3V3 to -3V3
- 3V3 to 2V5
- -3V3 to -2V5
- Sensor Input

### Library data of the parts
C33 C34 C39 C41 C46-C48 = EMK105BJ105KV-F: as C1 on sheet EEG Front-End; Manufacturer Part Number: EMK105BJ105KV-F; VNPT Part Number: EMK105BJ105KV-F; Capacitance: 1uF; Voltage - Rated: 16V; Tolerance: 10%; Mounting Type: Surface Mount (SMD); Package: 0402; Temperature Coefficient: X5R
C35 C37 C38 C40 C42 C44 C45 = LMK107BBJ106MAHT: as C5 on sheet EEG Front-End; Manufacturer Part Number: LMK107BBJ106MAHT; VNPT Part Number: LMK107BBJ106MAHT; Capacitance: 10uF; Voltage - Rated: 10V; Tolerance: 20%; Mounting Type: Surface Mount (SMD); Package: 0603; Temperature Coefficient: X5R
C36 C43 = TMK105CBJ225MV-F: as C29 on sheet MainBoardNew; Manufacturer Part Number: TMK105CBJ225MV-F; VNPT Part Number: TMK105CBJ225MV-F; Capacitance: 2.2uF; Voltage - Rated: 25V; Tolerance: 20%; Mounting Type: Surface Mount (SMD); Package: 0402; Temperature Coefficient: X5R
C49-C58 = TMK105BJ104MV-F: as C4 on sheet EEG Front-End; Manufacturer Part Number: TMK105BJ104MV-F; VNPT Part Number: TMK105BJ104MV-F; Capacitance: 0.1uF; Voltage - Rated: 25V; Tolerance: 20%; Mounting Type: Surface Mount (SMD); Package: 0402; Temperature Coefficient: X5R
F7 = BLM31KN271BH1L: FERRITE BEAD,120 OHMS @ 100MHZ,0.0016R,3A,1206,SMD; Manufacturer: Murata Electronics; No: 10; Manufacturer Part Number: BLM31KN271BH1L; VNPT Part Number: BLM31KN271BH1L; Impedance: 120 Ohms @ 100MHz; DC Resistance (DCR): 0.0016R; Current Rating: 3A; Mounting Type: Surface Mount (SMD); Package: 1206
J3-J12 = SM03B-SRSS-TB(LF)(SN): CONN HEADER SMD R/A 3POS 1MM; Manufacturer: JST Sales America Inc.; Manufacturer Part Number: SM03B-SRSS-TB(LF)(SN)
L1-L3 = MLZ1608N3R3LT000: IND,3.3UH,20%,450MA,0.027R,0603,SMD; Manufacturer: TDK Corporation; No: 27; Inductor Type: Multilayer; Manufacturer Part Number: MLZ1608N3R3LT000; VNPT Part Number: MLZ1608N3R3LT000; Inductance: 3.3uH; Tolerance: 20%; Current Rating: 450mA; DC Resistance (DCR): 0.027R; Mounting Type: Surface Mount (SMD); Package: 0603
R27-R36 = RC0402FR-072K2L: RES,2.2KR,1%,62.5MW,0402,SMD; Manufacturer: Yageo; No: 109; Manufacturer Part Number: RC0402FR-072K2L; VNPT Part Number: RC0402FR-072K2L; Resistance: 2.2kR; Tolerance: 1%; Power: 62.5mW; Resistor Type: Genneral Purpose Resistor; Mounting Type: Surface Mount (SMD); Package: 0402
TP7-TP9 = TP_25MILC: Test Point 25mil
U5 = TPS72325DBVR: IC REG LIN -2.5V 200MA SOT23-5; Manufacturer: Texas Instruments; Manufacturer Part Number: TPS72325DBVR
U6 = TPS60403DBVT: TPS60403 60MA CHARGE PUMP VOLTAG; Manufacturer: Texas Instruments; Manufacturer Part Number: TPS60403DBVT
U7 = TPS73225DBVR: IC REG LINEAR 2.5V 250MA SOT23-5; Manufacturer: Texas Instruments; Manufacturer Part Number: TPS73225DBVR
U8-U11 = TPD4E1B06DRLR: TVS DIODE 5.5VWM 14.5VC 6SOT; Manufacturer: Texas Instruments; Manufacturer Part Number: TPD4E1B06DRLR

## Nets that join several sheets
-2.5V: EEG Front-End (21 pins), PWR & Sensor Input (13 pins)
AGND: EEG Front-End (19 pins), PWR & Sensor Input (32 pins)
AVDD: EEG Front-End (16 pins), PWR & Sensor Input (13 pins)
DGND: EEG Front-End (6 pins), MainBoardNew (R18.1)
GND: EEG Front-End (R10.1), MainBoardNew (39 pins)
GND_SH: MainBoardNew (6 pins), PWR & Sensor Input (20 pins)
VDD_3V3: EEG Front-End (F9.1 J1.10), MainBoardNew (26 pins), PWR & Sensor Input (F7.1)
ADS_CLKSEL: EEG Front-End (R1.1 U1.52), MainBoardNew (CN2.54)
ADS_DIN: EEG Front-End (J1.4 U1.34), MainBoardNew (CN2.42)
ADS_DOUT: EEG Front-End (J1.8 U1.43), MainBoardNew (CN2.40)
ADS_nCS: EEG Front-End (J1.6 U1.39), MainBoardNew (CN2.36)
ADS_nDRDY: EEG Front-End (J1.9 U1.47), MainBoardNew (CN2.52)
ADS_nPWDN: EEG Front-End (J1.3 R5.1 U1.35), MainBoardNew (CN2.46)
ADS_nRST: EEG Front-End (J1.2 U1.36), MainBoardNew (CN2.48)
ADS_SCLK: EEG Front-End (J1.5 U1.40), MainBoardNew (CN2.38)
ADS_START: EEG Front-End (J1.1 U1.38), MainBoardNew (CN2.50)
AINP1: EEG Front-End (U1.16), PWR & Sensor Input (C49.2 R27.1)
AINP2: EEG Front-End (U1.14), PWR & Sensor Input (C50.2 R28.1)
AINP3: EEG Front-End (U1.12), PWR & Sensor Input (C51.2 R29.1)
AINP4: EEG Front-End (U1.10), PWR & Sensor Input (C52.2 R30.1)
AINP5: EEG Front-End (U1.8), PWR & Sensor Input (C53.2 R31.1)
AINP6: EEG Front-End (U1.6), PWR & Sensor Input (C54.2 R32.1)
AINP7: EEG Front-End (U1.4), PWR & Sensor Input (C55.2 R33.1)
AINP8: EEG Front-End (U1.2), PWR & Sensor Input (C56.2 R34.1)
BIAS_ELEC: EEG Front-End (SB2.1 SB9.1), PWR & Sensor Input (C58.2 R36.1)
REF_ELEC: EEG Front-End (SB4.2 SB6.2), PWR & Sensor Input (C57.2 R35.1)